# EAGLE design Microcontroller 1.2 (EAGLE 7.7.0)
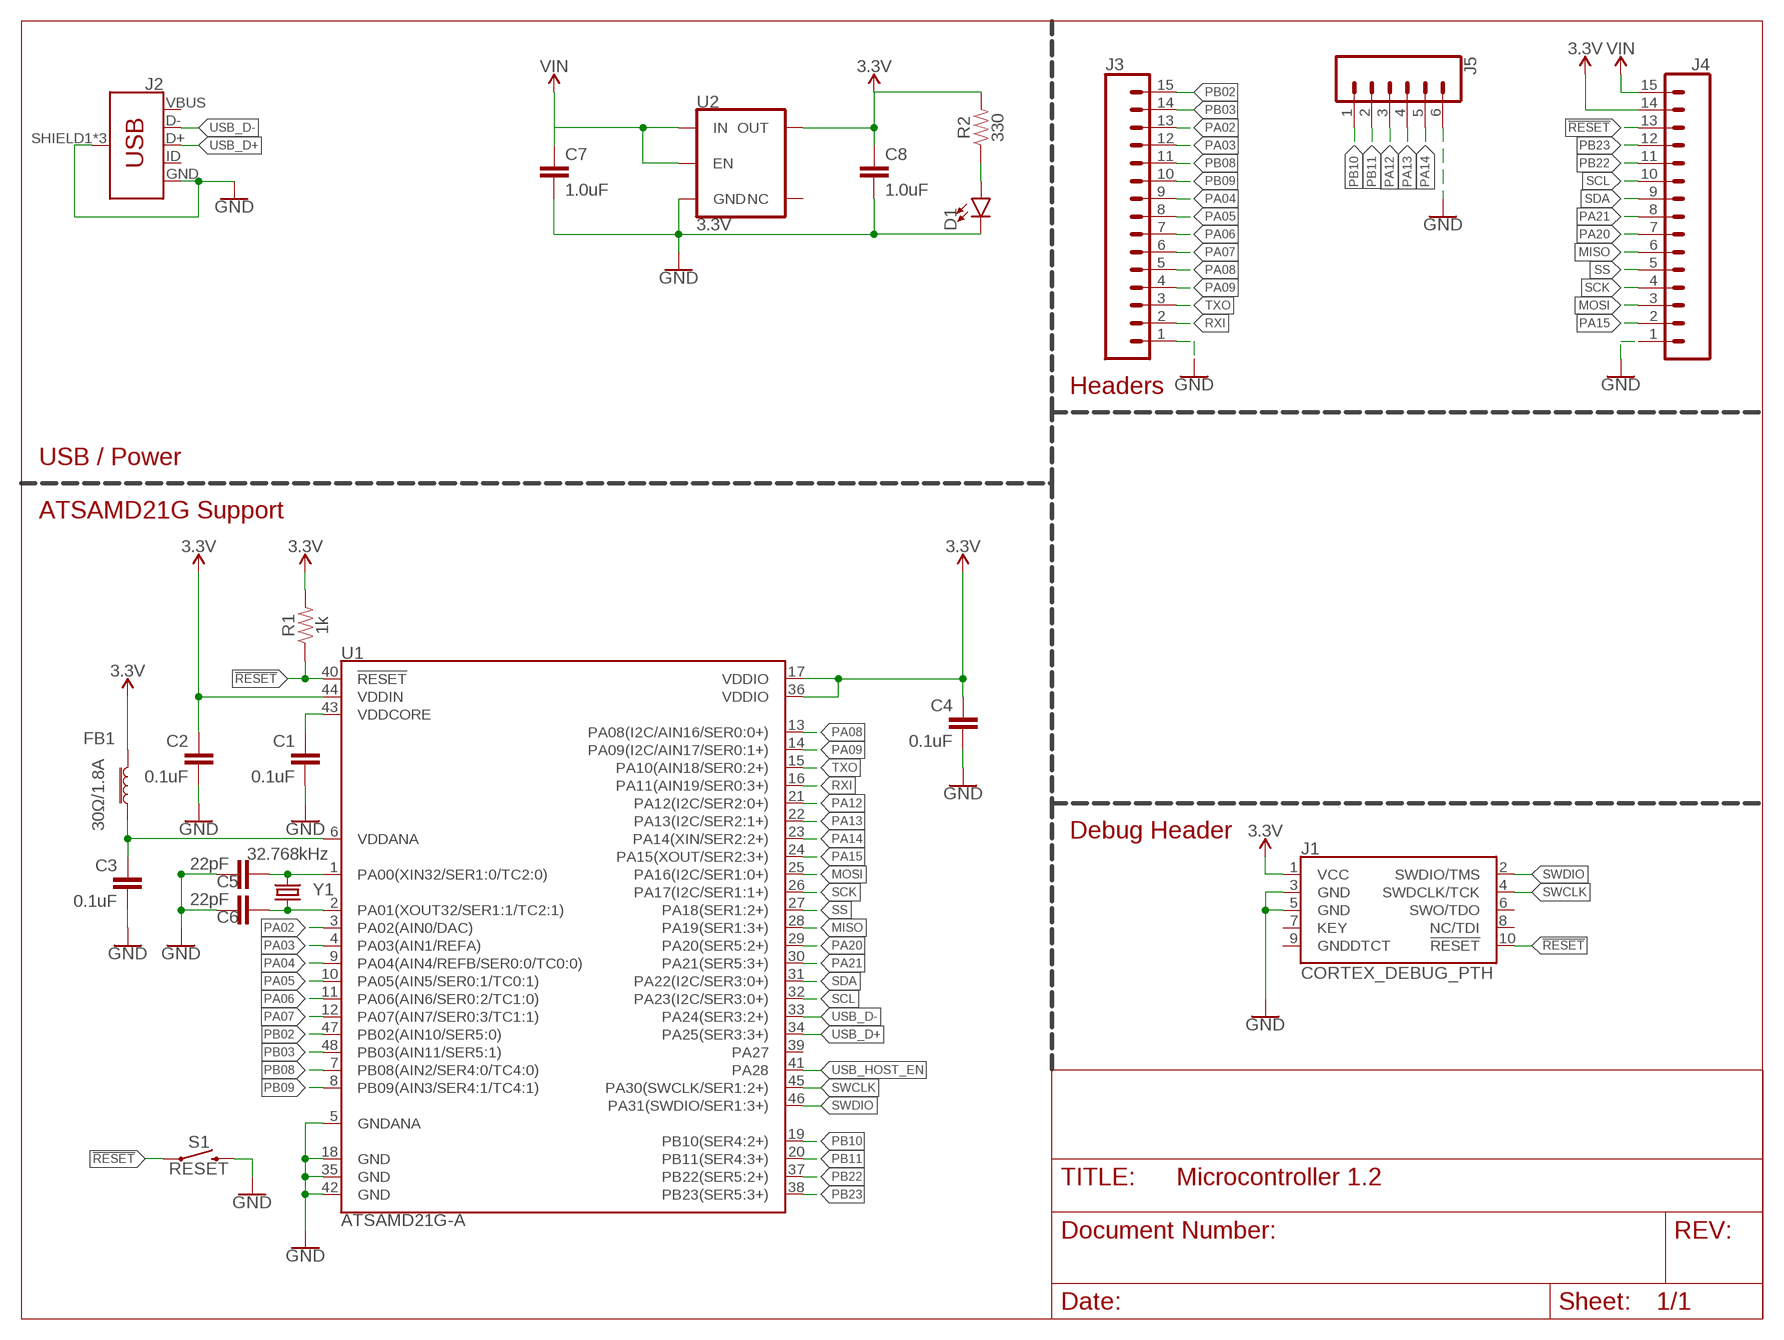
[diagram p0: schematic, sheet 1]

## Parts
C1  0.1uF  0.1UF-KIT-EZ-50V-20%  [CAP-PTH-SMALL-KIT]
C2  0.1uF  0.1UF-KIT-EZ-50V-20%  [CAP-PTH-SMALL-KIT]
C3  0.1uF  0.1UF-KIT-EZ-50V-20%  [CAP-PTH-SMALL-KIT]
C4  0.1uF  0.1UF-KIT-EZ-50V-20%  [CAP-PTH-SMALL-KIT]
C5  22pF  0.1UF-KIT-EZ-50V-20%  [CAP-PTH-SMALL-KIT]
C6  22pF  0.1UF-KIT-EZ-50V-20%  [CAP-PTH-SMALL-KIT]
C7  1.0uF  0.1UF-KIT-EZ-50V-20%  [CAP-PTH-SMALL-KIT]
C8  1.0uF  0.1UF-KIT-EZ-50V-20%  [CAP-PTH-SMALL-KIT]
D1  LED5MM  [LED_5MM]
FB1  30Ω/1.8A  FERRITE_BEAD-0603  [0603]
J1  CORTEX_DEBUG_PTH  [2X5-PTH-1.27MM]
J2  USB_MICRO-B_FEMALE-SMT  [USB-B-MICRO-SMD]
J3  CONN_15LOCK  [1X15_LOCK]
J4  CONN_15LOCK  [1X15_LOCK]
J5  CONN_06LOCK  [1X06_LOCK]
R1  1k  1KOHM-HORIZ-1/4W-1%  [AXIAL-0.3]
R2  330  1KOHM-HORIZ-1/4W-1%  [AXIAL-0.3]
S1  RESET  MOMENTARY-SWITCH-SPST-PTH-RIGHT-ANGLE-KIT  [TACTILE_SWITCH_PTH_RIGHT_ANGLE_KIT]
U1  ATSAMD21G-A  [TQFP-48]
U2  3.3V  V_REG_AP2112K-3.3V  [SOT23-5]
Y1  32.768kHz  CRYSTAL-32.768KHZPTH-2X6  [CRYSTAL-PTH-2X6-CYL]

## Nets
3.3V: C2.1 C4.1 C8.1 FB1.1 J1.1(VCC) J4.14 R1.P$2 R2.P$2 U1.17(VDDIO) U1.36(VDDIO) U1.44(VDDIN) U2.5(OUT)
!RESET: J1.10(!RESET) J4.13 R1.P$1 S1.1 U1.40(!RESET!)
GND: C1.2 C2.2 C3.2 C4.2 C5.1 C6.1 C7.2 C8.2 D1.K(C) J1.3(GND) J1.5(GND) J2.GND J2.SHIELD1(SHIELD) J2.SHIELD2(SHIELD) J2.SHIELD3(SHIELD) J3.1 J4.1 J5.6 S1.2 U1.5(GNDANA) U1.18(GND) U1.35(GND) U1.42(GND) U2.2(GND)
MISO: J4.6 U1.28(PA19(SER1:3+))
MOSI: J4.3 U1.25(PA16(I2C/SER1:0+))
N$1: C1.1 U1.43(VDDCORE)
N$2: C6.2 U1.2(PA01(XOUT32/SER1:1/TC2:1)) Y1.1
N$3: C3.1 FB1.2 U1.6(VDDANA)
N$4: C5.2 U1.1(PA00(XIN32/SER1:0/TC2:0)) Y1.2
N$7: D1.A R2.P$1
PA02: J3.13 U1.3(PA02(AIN0/DAC))
PA03: J3.12 U1.4(PA03(AIN1/REFA))
PA04: J3.9 U1.9(PA04(AIN4/REFB/SER0:0/TC0:0))
PA05: J3.8 U1.10(PA05(AIN5/SER0:1/TC0:1))
PA06: J3.7 U1.11(PA06(AIN6/SER0:2/TC1:0))
PA07: J3.6 U1.12(PA07(AIN7/SER0:3/TC1:1))
PA08: J3.5 U1.13(PA08(I2C/AIN16/SER0:0+))
PA09: J3.4 U1.14(PA09(I2C/AIN17/SER0:1+))
PA12: J5.3 U1.21(PA12(I2C/SER2:0+))
PA13: J5.4 U1.22(PA13(I2C/SER2:1+))
PA14: J5.5 U1.23(PA14(XIN/SER2:2+))
PA15: J4.2 U1.24(PA15(XOUT/SER2:3+))
PA20: J4.7 U1.29(PA20(SER5:2+))
PA21: J4.8 U1.30(PA21(SER5:3+))
PB02: J3.15 U1.47(PB02(AIN10/SER5:0))
PB03: J3.14 U1.48(PB03(AIN11/SER5:1))
PB08: J3.11 U1.7(PB08(AIN2/SER4:0/TC4:0))
PB09: J3.10 U1.8(PB09(AIN3/SER4:1/TC4:1))
PB10: J5.1 U1.19(PB10(SER4:2+))
PB11: J5.2 U1.20(PB11(SER4:3+))
PB22: J4.11 U1.37(PB22(SER5:2+))
PB23: J4.12 U1.38(PB23(SER5:3+))
RXI: J3.2 U1.16(PA11(AIN19/SER0:3+))
SCK: J4.4 U1.26(PA17(I2C/SER1:1+))
SCL: J4.10 U1.32(PA23(I2C/SER3:0+))
SDA: J4.9 U1.31(PA22(I2C/SER3:0+))
SS: J4.5 U1.27(PA18(SER1:2+))
SWCLK: J1.4(SWDCLK/TCK) U1.45(PA30(SWCLK/SER1:2+))
SWDIO: J1.2(SWDIO/TMS) U1.46(PA31(SWDIO/SER1:3+))
TXO: J3.3 U1.15(PA10(AIN18/SER0:2+))
USB_D+: J2.D+ U1.34(PA25(SER3:3+))
USB_D-: J2.D- U1.33(PA24(SER3:2+))
USB_HOST_EN: U1.41(PA28)
VIN: C7.1 J4.15 U2.1(IN) U2.3(EN)
Unconnected: J1.6(SWO/TDO) J1.7(KEY) J1.8(NC/TDI) J1.9(GNDDTCT) J2.ID U1.39(PA27) U2.4(NC)

## Notes on the sheet
- Headers
- USB / Power
- ATSAMD21G Support
- Debug Header

## Power pins joined to a net without a drawn wire
VBUS: J2.VBUS

## Library data of the parts
C1-C4 = SparkFun-Capacitors:0.1UF: 0.1µF ceramic capacitors A capacitor is a passive two-terminal electrical component used to store electrical energy temporarily in an electric field.; PROD_ID: CAP-08370
C5-C8 = SparkFun-Capacitors:0.1UF: 0.1µF ceramic capacitors A capacitor is a passive two-terminal electrical component used to store electrical energy temporarily in an electric field.; PROD_ID: CAP-08370; VALUE: 0.1uF
D1 = SparkFun-LED:LED: LED (Generic) Standard schematic elements and footprints for 5mm, 3mm, 1206, and 0603 sized LEDs. Generic LEDs with no color specified.
FB1 = SparkFun-Coils:FERRITE_BEAD: Ferrite Bead (blocks, cores, rings, chokes, etc.) Inductor with layers of ferrite used to suppress high frequencies. Often used to isolate high frequency noise. SparkFun Products: IOIO-OTG - V2.2 <https://www.sparkfun.com/products/13613> SparkFun SAMD21 Mini Breakout <https://www.sparkfun.com/products/13664> SparkFun 6 Degrees of Freedom Breakout - LSM6DS3 <https://www.sparkfun.com/products/13339> SparkFun SAMD21 Dev Breakout <https://www.sparkfun.com/products/13672>; PROD_ID: NDUC-07859
J1 = SparkFun-Connectors:CORTEX_DEBUG: Cortex Debug Connector - 10 pin Supports JTAG debug, Serial Wire debug, and Serial Wire Viewer. PTH and SMD connector options available. General Connector Information <http://infocenter.arm.com/help/topic/com.arm.doc.faqs/attached/13634/cortex_debug_connectors.pdf> Products: PTH Connector <http://www.digikey.com/product-detail/en/cnc-tech/3220-10-0100-00/1175-1627-ND/3883661> -via Digi-Key SparkFun PSoc <https://www.sparkfun.com/products/13229> SparkFun T <https://www.sparkfun.com/products/13810>
J2 = SparkFun-Connectors:USB_MICRO-B: USB Type Micro-B Connector Male/female and PTH/SMT variants SparkFun Products: SparkFun microB USB Breakout <https://www.sparkfun.com/products/12035> SparkFun USB microB Plug Breakout <https://www.sparkfun.com/products/10031> SparkFun ESP8266 Thing <https://www.sparkfun.com/products/13231>; PROD_ID: CONN-11752
J3 J4 = SparkFun-Connectors:CONN_15: Multi connection point. Often used as Generic Header-pin footprint for 0.1 inch spaced/style header connections On any of the 0.1 inch spaced packages, you can populate with these: Break Away Headers - Straight <https://www.sparkfun.com/products/116> (PRT-00116) Break Away Male Headers - Right Angle <https://www.sparkfun.com/products/553> (PRT-00553) Female Headers <https://www.sparkfun.com/products/115> (PRT-00115) Break Away Headers - Machine Pin <https://www.sparkfun.com/products/117> (PRT-00117) Break Away Female Headers - Swiss Machine Pin <https://www.sparkfun.com/products/743> (PRT-00743) For SCREWTERMINALS and SPRING TERMINALS visit here: Screw Terimnals on SparkFun.com <https://www.sparkfun.com/search/results?term=Screw+Terminals> (5mm/3.5mm/2.54mm spacing) This device is also useful as a general connection point to wire up your design to another part of your project. Our various solder wires solder well into these plated through hole pads. Hook-Up Wire - Assortment (Stranded, 22 AWG) <https://www.sparkfun.com/products/11375> (PRT-11375) Hook-Up Wire - Assortment (Solid Core, 22 AWG) <https://www.sparkfun.com/products/11367> (PRT-11367) View the entire wire category on our website here <https://www.sparkfun.com/categories/141> Special notes: Molex polarized connector foot print use with SKU : PRT-08231 with associated crimp pins and housings. 1MM SMD Version SKU: PRT-10208 NOTES ON THE VARIANTS LOCK and LOCK_LONGPADS... This footprint was designed to help hold the alignment of a through-hole component (i.e. 6-pin header) while soldering it into place. You may notice that each hole has been shifted either up or down by 0.005 of an inch from it's more standard position (which is a perfectly straight line). This slight alteration caused the pins (the squares in the middle) to touch the edges of the holes. Because they are alternating, it causes a "brace" to hold the component in place. 0.005 has proven to be the perfect amount of "off-center" position when using our standard breakaway headers. Although looks a little odd when you look at the bare footprint, once you have a header in there, the alteration is very hard to notice. Also,if you push a header all the way into place, it is covered up entirely on the bottom side.
J5 = SparkFun-Connectors:CONN_06: Multi connection point. Often used as Generic Header-pin footprint for 0.1 inch spaced/style header connections On any of the 0.1 inch spaced packages, you can populate with these: Break Away Headers - Straight <https://www.sparkfun.com/products/116> (PRT-00116) Break Away Male Headers - Right Angle <https://www.sparkfun.com/products/553> (PRT-00553) Female Headers <https://www.sparkfun.com/products/115> (PRT-00115) Break Away Headers - Machine Pin <https://www.sparkfun.com/products/117> (PRT-00117) Break Away Female Headers - Swiss Machine Pin <https://www.sparkfun.com/products/743> (PRT-00743) Arduino Stackable Header - 6 Pin <https://www.sparkfun.com/products/9280> (PRT-09280) For SCREWTERMINALS and SPRING TERMINALS visit here: Screw Terimnals on SparkFun.com <https://www.sparkfun.com/search/results?term=Screw+Terminals> (5mm/3.5mm/2.54mm spacing) This device is also useful as a general connection point to wire up your design to another part of your project. Our various solder wires solder well into these plated through hole pads. Hook-Up Wire - Assortment (Stranded, 22 AWG) <https://www.sparkfun.com/products/11375> (PRT-11375) Hook-Up Wire - Assortment (Solid Core, 22 AWG) <https://www.sparkfun.com/products/11367> (PRT-11367) View the entire wire category on our website here <https://www.sparkfun.com/categories/141>
R1 = SparkFun-Resistors:1KOHM: 1kΩ resistor A resistor is a passive two-terminal electrical component that implements electrical resistance as a circuit element. Resistors act to reduce current flow, and, at the same time, act to lower voltage levels within circuits. - Wikipedia; PROD_ID: RES-12182
R2 = SparkFun-Resistors:1KOHM: 1kΩ resistor A resistor is a passive two-terminal electrical component that implements electrical resistance as a circuit element. Resistors act to reduce current flow, and, at the same time, act to lower voltage levels within circuits. - Wikipedia; PROD_ID: RES-12182; VALUE: 1k
S1 = SparkFun-Switches:MOMENTARY-SWITCH-SPST: Momentary Switch (Pushbutton) - SPST Normally-open (NO) SPST momentary switches (buttons, pushbuttons). Variants PTH-12MM - 12mm square, through-hole Momentary Pushbutton Switch - 12mm Square <https://www.sparkfun.com/products/9190> (COM-09190) PTH-6.0MM, PTH-6.0MM-KIT - 6.0mm square, through-hole Mini Pushbutton Switch <https://www.sparkfun.com/products/97> (COM-00097) KIT package intended for soldering kit's - only one side of pads' copper is exposed. PTH-RIGHT-ANGLE-KIT - Right-angle, through-hole Right Angle Tactile Button <https://www.sparkfun.com/products/10791> - Used on SparkFun BigTime Watch Kit <https://www.sparkfun.com/products/11734> SMD-12MM - 12mm square, surface-mount Tactile Button - SMD (12mm) <https://www.sparkfun.com/products/12993> (COM-12993) Used on SparkFun PicoBoard <https://www.sparkfun.com/products/11888> SMD-4.5MM - 4.5mm Square Trackball Switch Used on SparkFun Blackberry Trackballer Breakout <https://www.sparkfun.com/products/13169> SMD-4.6MMX2.8MM - 4.60mm x 2.80mm, surface mount Used on SparkFun SAMD21 Mini Breakout <https://www.sparkfun.com/products/13664> SMD-5.2MM, SMD-5.2-REDUNDANT - 5.2mm square, surface-mount Mini Pushbutton Switch - SMD <https://www.sparkfun.com/products/8720> (COM-08720) Used on Arduino Pro Mini <https://www.sparkfun.com/products/11114> REDUNDANT package connects both switch circuits together SMD-6.0X3.5MM - 6.0 x 3.5mm, surface mount Momentary Reset Switch SMD <https://www.sparkfun.com/products/8229> (COM-08229) SMD-6.2MM-TALL - 6.2mm square, surface mount Tactile Button - SMD (6mm) <https://www.sparkfun.com/products/12992> Used on SparkFun Digital Sandbox <https://www.sparkfun.com/products/12651> SMD-RIGHT-ANGLE - Right-angle, surface mount Used on SparkFun Block for Intel® Edison - Arduino <https://www.sparkfun.com/products/13036>; PROD_ID: CONN-10672; SF_SKU: COM-10791
U1 = SparkFun-IC-Microcontroller:ATSAMD21G: Atmel SAMD21G SMART ARM-Based Microcontroller The Atmel ® | SMART ™ SAM D21 is a series of low-power microcontrollers using the 32-bit ARM ® Cortex ® -M0+ processor, and ranging from 32- to 64-pins with up to 256KB Flash and 32KB of SRAM. The SAM D21 devices operate at a maximum frequency of 48MHz and reach 2.46 CoreMark/MHz. They are designed for simple and intuitive migration with identical peripheral modules, hex compatible code, identical linear address map and pin compatible migration paths between all devices in the product series. All devices include intelligent and flexible peripherals, Atmel Event System for inter-peripheral signaling, and support for capacitive touch button, slider and wheel user interfaces. Datasheet <https://cdn.sparkfun.com/datasheets/Dev/Arduino/Boards/Atmel-42181-SAM-D21_Datasheet.pdf> SparkFun Products SparkFun SAMD21 Mini Breakout <https://www.sparkfun.com/products/13664> (DEV-13664) SparkFun SAMD21 Dev Breakout <https://www.sparkfun.com/products/13672> (DEV-13672); PROD_ID: IC-13064
U2 = SparkFun-IC-Power:V_REG_AP2112: AP2112 - 600mA CMOS LDO Regulator w/ Enable The AP2112 is CMOS process low dropout linear regulator with enable function, the regulator delivers a guaranteed 600mA (min.) continuous load current. Features Output Voltage Accuracy: ±1.5% Output Current: 600mA (Min.) Foldback Short Current Protection: 50mA Enable Function to Turn ON/OFF VOUT Low Dropout Voltage (3.3V): 250mV (Typ.) @IOUT=600mA Excellent Load Regulation: 0.2%/A (Typ.) Excellent Line Regulation: 0.02%/V (Typ.) Low Quiescent Current: 55μA (Typ.) Low Standby Current: 0.01μA (Typ.) Low Output Noise: 50μVRMS PSRR: 100Hz -65dB, 1kHz -65dB OTSD Protection Stable with 1.0μF Flexible Cap: Ceramic, Tantalum and Aluminum Electrolytic Operation Temperature Range: -40°C to 85°C ESD: MM 400V, HBM 4000V; PROD_ID: VREG-12457
Y1 = SparkFun-Clocks:CRYSTAL-32.768KHZ: 32.768kHz Crystal Frequency: 32.768kHz Frequency Stability: ±20ppm Load Capacitance: 12.5pF (PTH-2X6 & SMD-3.2X1.5), 6pF (SMD-2X6) SparkFun Products: SparkFun BigTime Watch Kit <https://www.sparkfun.com/products/11734> SparkFun nRF52832 Breakout <https://www.sparkfun.com/products/13990> SparkFun Real Time Clock Module <https://www.sparkfun.com/products/12708>; PROD_ID: XTAL-10112

## Board
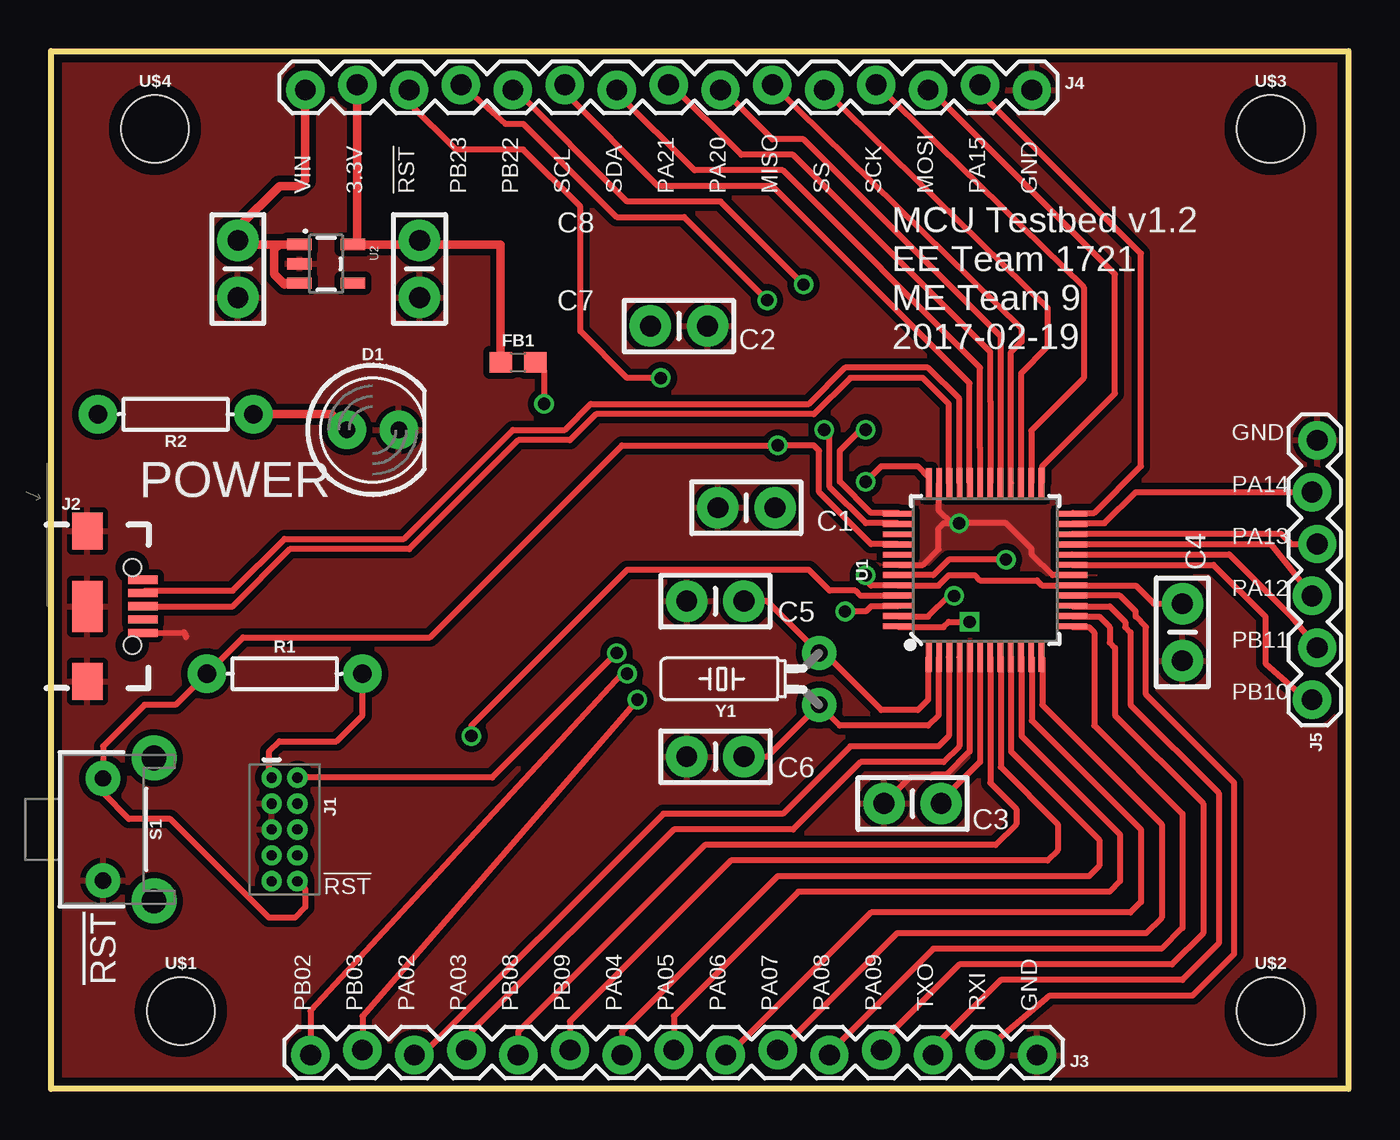
[diagram p1: board, top side]
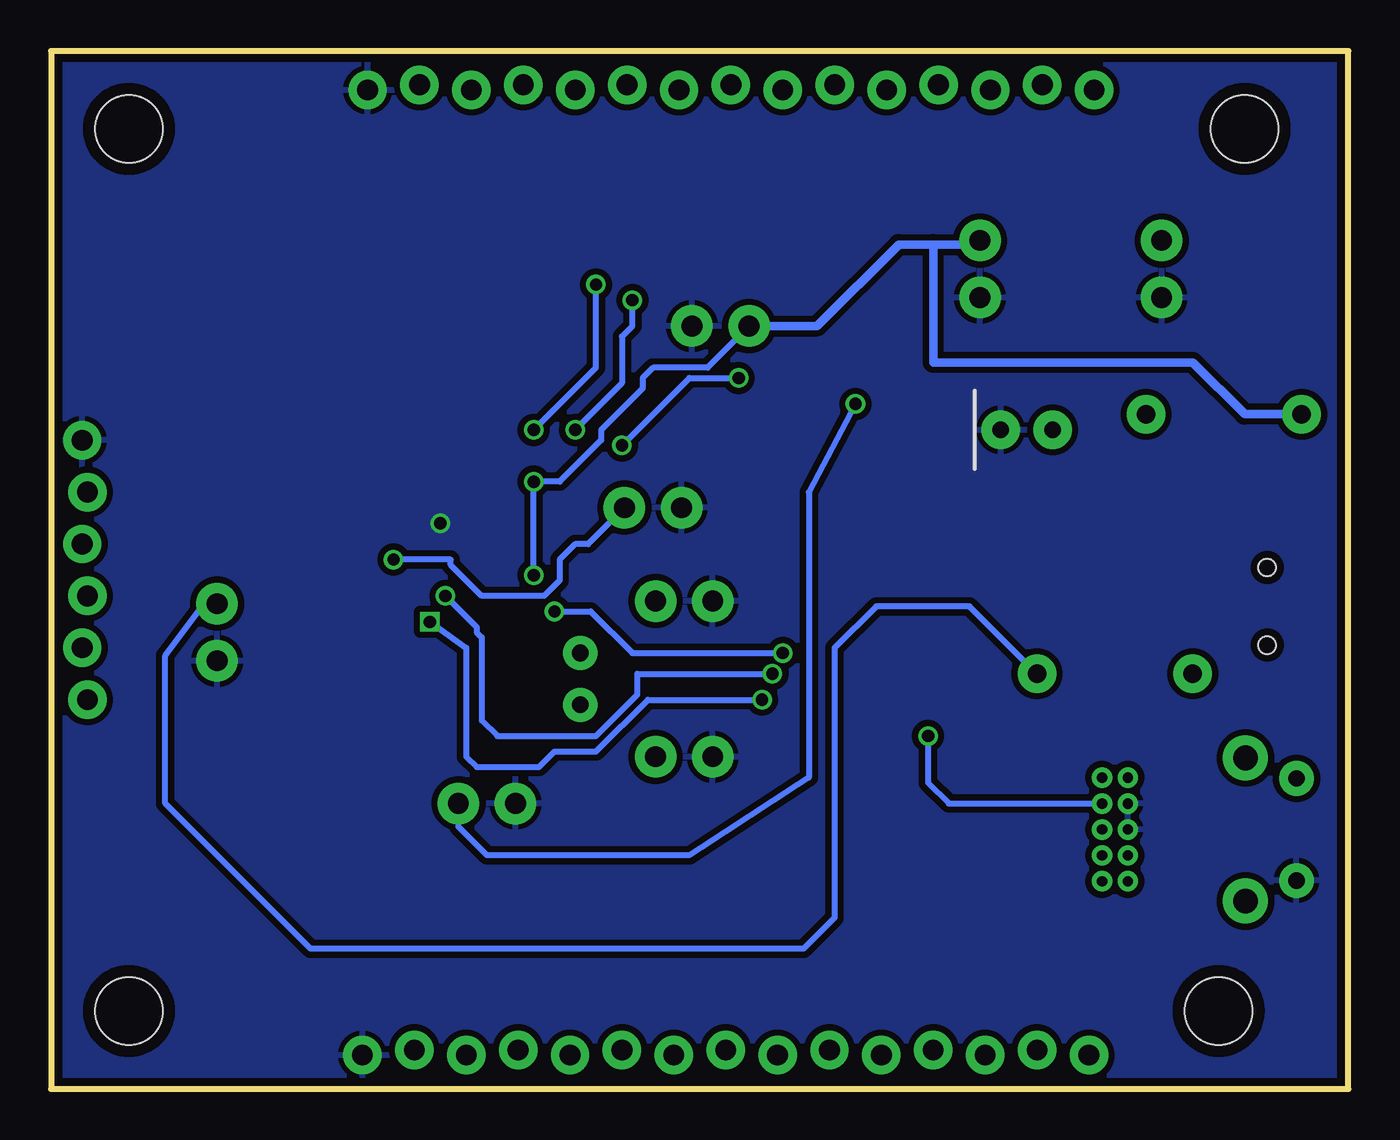
[diagram p2: board, bottom side, seen from below]

Size 63.5 x 50.8 mm. Coordinates in mm from the lower left corner, seen from the top.
Outline: 0,0 0,50.8 63.5,50.8 63.5,0 0,0
Copper layers (1*16): Top 0.0356mm / dielectric 1.5011mm / Bottom 0.0356mm
Design rules "oshpark-2layer": minimum track width 6mil, minimum drill 13mil, track to track 6mil, track to pad 6mil, pad to pad 6mil, via to via 6mil, smd to smd 6mil, copper to edge 15mil, drill to drill 6mil, minimum pad ring 7mil, minimum via ring 7mil, stop-mask expansion 2.5mil, vias tented up to drill 0mil, thermal gap 10mil

### Footprints (pad centres in the part's own frame; a part is rotated, then mirrored left to right if it is on the bottom)
CAP-PTH-SMALL-KIT = drill 1.016 pad 2.032: 1 -1.397,0; 2 1.397,0
LED_5MM = drill 0.813 pad 1.88: A -1.27,0; K 1.27,0
0603 = smd 1.1 x 1: 1 -0.85,0; 2 0.85,0
2X5-PTH-1.27MM = drill 0.508 pad 1: 1 -2.54,-0.635; 2 -2.54,0.635; 3 -1.27,-0.635; 4 -1.27,0.635; 5 0,-0.635; 6 0,0.635; 7 1.27,-0.635; 8 1.27,0.635; 9 2.54,-0.635; 10 2.54,0.635
USB-B-MICRO-SMD = smd 1.45 x 0.4: D+ 2.725,0; D- 2.725,0.65; GND 2.725,-1.3; ID 2.725,-0.65; VBUS 2.725,1.3 | smd 1.5 x 1.8: SHIELD1 0,3.685; SHIELD2 0,-3.685 | smd 1.5 x 2.5: SHIELD3 0,0 | hole 0.85: 2.2,1.9; 2.2,-1.9
1X15_LOCK = drill 1.016 pad 1.88: 1 0,0.127; 2 2.54,-0.127; 3 5.08,0.127; 4 7.62,-0.127; 5 10.16,0.127; 6 12.7,-0.127; 7 15.24,0.127; 8 17.78,-0.127; 9 20.32,0.127; 10 22.86,-0.127; 11 25.4,0.127; 12 27.94,-0.127; 13 30.48,0.127; 14 33.02,-0.127; 15 35.56,0.127
1X06_LOCK = drill 1.016 pad 1.88: 1 0,0; 2 2.54,-0.254; 3 5.08,0; 4 7.62,-0.254; 5 10.16,0; 6 12.7,-0.254
AXIAL-0.3 = drill 0.9 pad 1.88: P$1 -3.81,0; P$2 3.81,0
TACTILE_SWITCH_PTH_RIGHT_ANGLE_KIT = drill 0.8 pad 1.7: 1 -2.5,0; 2 2.5,0 | drill 1.2 pad 2.2: ANCHOR1 -3.5,2.5; ANCHOR2 3.5,2.5
TQFP-48 = smd 1.5 x 0.28: 1 -4.25,2.75; 2 -4.25,2.25; 3 -4.25,1.75; 4 -4.25,1.25; 5 -4.25,0.75; 6 -4.25,0.25; 7 -4.25,-0.25; 8 -4.25,-0.75; 9 -4.25,-1.25; 10 -4.25,-1.75; 11 -4.25,-2.25; 12 -4.25,-2.75; 25 4.25,-2.75; 26 4.25,-2.25; 27 4.25,-1.75; 28 4.25,-1.25; 29 4.25,-0.75; 30 4.25,-0.25; 31 4.25,0.25; 32 4.25,0.75; 33 4.25,1.25; 34 4.25,1.75; 35 4.25,2.25; 36 4.25,2.75 | smd 0.28 x 1.5: 13 -2.75,-4.25; 14 -2.25,-4.25; 15 -1.75,-4.25; 16 -1.25,-4.25; 17 -0.75,-4.25; 18 -0.25,-4.25; 19 0.25,-4.25; 20 0.75,-4.25; 21 1.25,-4.25; 22 1.75,-4.25; 23 2.25,-4.25; 24 2.75,-4.25; 37 2.75,4.25; 38 2.25,4.25; 39 1.75,4.25; 40 1.25,4.25; 41 0.75,4.25; 42 0.25,4.25; 43 -0.25,4.25; 44 -0.75,4.25; 45 -1.25,4.25; 46 -1.75,4.25; 47 -2.25,4.25; 48 -2.75,4.25
SOT23-5 = smd 0.55 x 1.2: 1 -0.95,-1.3; 2 0,-1.3; 3 0.95,-1.3; 4 0.95,1.3; 5 -0.95,1.3
STAND-OFF = hole 3.302: 0,0
CRYSTAL-PTH-2X6-CYL = drill 0.813 pad 1.676: 1 -1.27,0; 2 1.27,0

### Placement (x,y rotation side)
C1  34.04,28.45 180 top
C2  30.73,37.34 0 top
C3  42.16,13.97 180 top
C4  55.37,22.35 270 top
C5  32.51,23.88 0 top
C6  32.51,16.26 0 top
C7  9.14,40.13 270 top
C8  18.03,40.13 270 top
D1  15.75,32.26 0 top
FB1  22.86,35.56 0 top
J1  11.43,12.7 270 top
J2  1.78,23.62 0 top
J3  48.26,1.78 180 top
J4  48.01,49.02 180 top
J5  61.72,19.05 90 top
R1  11.43,20.32 0 top
R2  6.1,33.02 180 top
S1  2.54,12.7 270 top
U1  45.72,25.4 90 top
U2  13.46,40.39 270 top
U$1  [STAND-OFF]  6.35,3.81 0 top
U$2  [STAND-OFF]  59.69,3.81 0 top
U$3  [STAND-OFF]  59.69,46.99 0 top
U$4  [STAND-OFF]  5.08,46.99 0 top
Y1  37.59,20.07 90 top

### Tracks (layer width: path | path; a pad name or v marks a point on that pad's centre or on a via)
3.3V  (via drill 0.6)
  Top 0.305: C4.1 53.98,23.75 53.09,24.64 49.98,24.64 U1.17 48.5,24.65 48.26,24.89 45.47,24.89 45.21,25.15 43.94,25.15 43.43,24.64 41.48,24.64 U1.44 41.46,24.64 40.13,24.64 39.88,24.89 v39.88,25.15 | J1.1 10.67,15.37 10.67,16.51 11.18,17.02 13.97,17.02 15.24,18.29 R1.P$2 | v39.88,29.72 40.64,30.48 42.42,30.48 42.97,29.93 U1.36
  Top 0.406: 18.03,41.34 U2.5 14.99,41.56 J4.14 | 18.03,41.34 C8.1 | 18.03,41.34 22.01,41.34 FB1.1
  Bottom 0.305: v39.88,25.15 v39.88,29.72 38.61,29.72 36.58,31.75 36.58,32.26 34.54,34.29 34.54,34.8 34.04,35.31 31.37,35.31 C2.1 | R1.P$2 18.54,23.62 23.11,23.62 25.15,21.59 25.15,8.38 26.67,6.86 50.8,6.86 57.91,13.97 57.91,21.21 56.01,23.75 C4.1
  Bottom 0.406: C2.1 26.01,37.34 22.01,41.34 20.32,41.34 | 20.32,41.34 18.23,41.34 C8.1 | R2.P$2 5.08,33.02 7.62,35.56 20.32,35.56 20.32,41.34
!RESET  (via drill 0.6)
  Top 0.305: J1.10 12.45,9.78 12.45,8.89 11.94,8.38 10.67,8.38 5.84,13.21 3.81,13.21 2.54,14.48 S1.1 2.54,16.76 4.57,18.8 6.1,18.8 R1.P$1 9.4,22.1 18.54,22.1 27.94,31.5 v35.56,31.5 37.34,31.5 37.59,31.24 37.59,29.21 40.13,26.67 41.45,26.67 U1.40 | v29.84,34.8 28.19,34.8 25.91,37.08 25.91,43.18 23.11,45.97 19.81,45.97 17.53,48.26 J4.13
  Bottom 0.305: v35.56,31.5 32.26,34.8 v29.84,34.8
GND  (via drill 0.6)
  Top 0.305: U1.42 42.67,25.65 43.43,26.42 43.43,27.43 43.69,27.69 44.07,27.69 | U1.35 43.43,29.61 43.43,28.32 44.07,27.69 | 44.07,27.69 v44.45,27.69 46.74,27.69 48.01,26.42 48.01,26.16 49.02,25.15 U1.18 | U1.5 44.96,21.14 44.96,16.51 43.81,15.37 43.18,15.37 43.05,15.24 42.04,15.24 C3.2 | J2.GND 6.5,22.35 6.6,22.1
  pour Bottom (isolate 0.305): 0,50.8 0,0 63.5,0 63.5,50.8
  pour Top (isolate 0.305): 0,50.8 0,0 63.5,0 63.5,50.8
MISO
  Top 0.305: U1.28 46.99,29.67 46.99,36.07 47.5,36.58 47.5,37.21 J4.6
MOSI
  Top 0.305: U1.25 48.51,29.69 48.51,30.48 52.07,34.04 52.07,39.88 42.93,49.02 J4.3
N$1  (via drill 0.6)
  Top 0.305: v46.74,25.91 43.94,25.91 43.18,25.15 U1.43
  Bottom 0.305: C1.1 37.21,26.67 37.85,26.67 38.61,25.91 38.61,24.89 39.37,24.13 42.42,24.13 43.94,25.65 43.94,25.91 v46.74,25.91
N$2
  Top 0.305: U1.2 43.43,21.11 43.43,18.29 42.93,17.78 38.61,17.78 Y1.1 35.05,16.26 C6.2
N$3  (via drill 0.6)
  Top 0.305: U1.6 45.47,16 43.56,14.1 C3.1 | FB1.2 24.13,35.14 v24.13,33.53
  Bottom 0.305: v24.13,33.53 26.42,29.21 26.42,15.24 32.26,11.43 42.16,11.43 43.56,12.83 C3.1
N$4
  Top 0.305: U1.1 42.93,21.11 42.93,19.05 42.42,18.54 40.64,18.54 37.85,21.34 Y1.2 35.05,23.88 C5.2
N$7
  Top 0.406: R2.P$1 13.72,33.02 D1.A
PA02
  Top 0.305: U1.3 43.94,21.12 43.94,17.27 43.43,16.76 39.12,16.76 35.81,13.46 29.97,13.46 17.78,1.27 J3.13
PA03
  Top 0.305: U1.4 44.45,21.13 44.45,16.76 43.69,16 39.62,16 36.32,12.7 30.48,12.7 20.32,2.54 J3.12
PA04
  Top 0.305: U1.9 46.99,21.13 46.99,16.51 51.31,12.19 51.31,10.92 50.8,10.41 35.56,10.41 27.94,2.79 J3.9
PA05
  Top 0.305: U1.10 47.5,21.12 47.5,17.27 52.32,12.45 52.32,10.16 51.82,9.65 36.58,9.65 30.48,3.56 J3.8
PA06
  Top 0.305: U1.11 48.01,21.11 48.01,18.03 53.34,12.7 53.34,9.14 52.83,8.64 40.13,8.64 33.02,1.52 J3.7
PA07
  Top 0.305: U1.12 48.51,21.11 48.51,18.8 54.36,12.95 54.36,8.38 53.59,7.62 41.4,7.62 35.56,1.78 J3.6
PA08
  Top 0.305: U1.13 50.01,22.61 50.8,22.61 51.05,22.35 51.05,17.78 55.37,13.46 55.37,7.87 54.36,6.86 43.18,6.86 38.1,1.78 J3.5
PA09
  Top 0.305: U1.14 50.01,23.11 51.31,23.11 51.82,22.61 51.82,21.84 52.07,21.59 52.07,18.29 56.39,13.97 56.39,7.62 54.86,6.1 44.45,6.1 40.64,2.29 J3.4
PA12
  Top 0.305: U1.21 49.99,26.67 59.69,26.67 J5.3
PA13
  Top 0.305: U1.22 50,27.18 60.2,27.18 60.71,26.67 J5.4
PA14
  Top 0.305: U1.23 50.01,27.69 51.56,27.69 53.09,29.21 J5.5
PA15
  Top 0.305: U1.24 50.01,28.19 51.05,28.19 53.34,30.48 53.34,40.89 45.47,48.77 J4.2
PA20
  Top 0.305: U1.29 46.47,35.45 46.48,35.46 46.48,36.83 36.83,46.48 35.31,46.48 32.77,49.02 J4.7
PA21
  Top 0.305: U1.30 45.97,33.66 45.97,36.07 36.32,45.72 33.78,45.72 30.23,49.28 J4.8
PB02  (via drill 0.6)
  Top 0.305: U1.47 41.51,23.11 42.93,23.11 43.94,24.13 v44.2,24.13 | v28.19,20.32 27.94,20.32 12.7,3.81 J3.15
  Bottom 0.305: v44.2,24.13 42.67,22.61 42.67,22.35 42.42,22.1 42.42,18.03 41.66,17.27 36.83,17.27 34.8,19.3 34.8,20.32 v28.19,20.32
PB03  (via drill 0.6)
  Top 0.305: U1.48 41.51,22.61 43.69,22.61 43.94,22.86 v44.96,22.86 | v28.7,19.05 15.24,3.56 J3.14
  Bottom 0.305: v44.96,22.86 43.18,21.59 43.18,16.26 42.67,15.75 39.62,15.75 38.86,16.51 36.83,16.51 34.29,19.05 v28.7,19.05
PB08
  Top 0.305: U1.7 45.97,14.99 47.24,13.72 47.24,12.95 46.23,11.94 32,11.94 22.86,2.79 J3.11
PB09
  Top 0.305: U1.8 46.48,21.14 46.48,15.75 49.28,12.95 49.28,11.68 48.77,11.18 33.27,11.18 25.4,3.3 J3.10
PB10
  Top 0.305: U1.19 56.9,25.65 59.44,23.11 59.44,20.83 61.47,19.05 J5.1
PB11
  Top 0.305: U1.20 49.98,26.16 57.66,26.16 60.71,23.11 J5.2
PB22  (via drill 0.6)
  Top 0.305: U1.37 41.43,28.19 40.13,28.19 38.61,29.72 38.61,31.24 39.62,32.26 v39.88,32.26 | J4.11 22.61,49.02 28.19,43.43 32.77,43.43 v36.83,39.37
  Bottom 0.305: v39.88,32.26 36.83,35.31 v36.83,39.37
PB23  (via drill 0.6)
  Top 0.305: U1.38 41.43,27.69 39.88,27.69 38.1,29.46 38.1,32 v37.85,32.26 | J4.12 22.23,47.24 23.11,47.24 27.69,42.67 30.99,42.67 v35.05,38.61
  Bottom 0.305: v37.85,32.26 35.56,34.54 35.56,36.83 35.05,37.34 v35.05,38.61
RXI
  Top 0.305: J3.2 48.9,4.57 55.88,4.57 57.91,6.6 57.91,14.99 53.59,19.3 53.59,22.61 53.09,23.11 53.09,23.37 52.3,24.15 U1.16
SCK
  Top 0.305: J4.4 50.55,39.24 50.55,34.8 47.97,32.22 U1.26
SCL
  Top 0.305: U1.32 44.96,29.66 44.96,34.54 35.31,44.2 29.72,44.2 25.15,48.77 J4.10
SDA
  Top 0.305: U1.31 45.47,31.36 45.47,31.37 45.47,35.31 35.81,44.96 31.5,44.96 27.69,48.77 J4.9
SS
  Top 0.305: J4.5 48.77,38.23 48.77,36.32 47.47,35.02 U1.27
SWCLK  (via drill 0.6)
  Top 0.305: U1.45 41.45,24.13 39.62,24.13 39.37,24.38 38.1,24.38 37.08,25.4 28.19,25.4 20.57,17.78 v20.57,17.27
  Bottom 0.305: v20.57,17.27 20.57,14.99 19.56,13.97 J1.4
SWDIO  (via drill 0.6)
  Top 0.305: U1.46 41.44,23.62 40.13,23.62 39.88,23.37 v38.86,23.37 | v27.69,21.34 21.59,15.24 J1.2
  Bottom 0.305: v38.86,23.37 37.08,23.37 35.05,21.34 v27.69,21.34
TXO
  Top 0.305: U1.15 50,23.62 51.82,23.62 52.58,22.86 52.58,22.61 52.83,22.35 52.83,18.8 57.15,14.48 57.15,7.11 55.37,5.33 46.48,5.33 43.18,2.03 J3.3
USB_D+
  Top 0.305: U1.34 43.94,29.68 43.94,33.53 42.67,34.8 39.12,34.8 37.34,33.02 26.67,33.02 25.4,31.75 22.86,31.75 17.53,26.42 11.68,26.42 8.89,23.62 J2.D+
USB_D-
  Top 0.305: U1.33 44.45,29.67 44.45,33.78 42.93,35.31 38.86,35.31 37.08,33.53 26.42,33.53 25.15,32.26 22.61,32.26 17.27,26.92 11.43,26.92 8.89,24.38 4.62,24.38 J2.D-
VIN
  Top 0.406: U2.1 11.18,41.34 | 11.18,41.34 9.14,41.34 C7.1 9.14,42.16 11.18,44.2 12.19,44.2 12.45,44.45 J4.15 | U2.3 11.5,39.44 11.43,39.37 10.92,39.88 10.92,41.08 11.18,41.34

### Text on the board
tPlace: VIN | 3.3V | !RST | PB23 | PB22 | SCL | SDA | PA21 | PA20 | MISO | SS | SCK | MOSI | PA15 | GND | C8 | MCU Testbed v1.2 | EE Team 1721 | C7 | ME Team 9 | C2 | 2017-02-19 | GND | POWER | PA14 | C1 | PA13 | C4 | PA12 | C5 | PB11 | PB10 | C6 | C3 | !RST | !RST | PB02 | PB03 | PA02 | PA03 | PB08 | PB09 | PA04 | PA05 | PA06 | PA07 | PA08 | PA09 | TXO | RXI | GND